# Altium schematic sheet FULL_CB_Servo_REV_C.SchDoc
size A4; DrawnBy: Philip Rowse
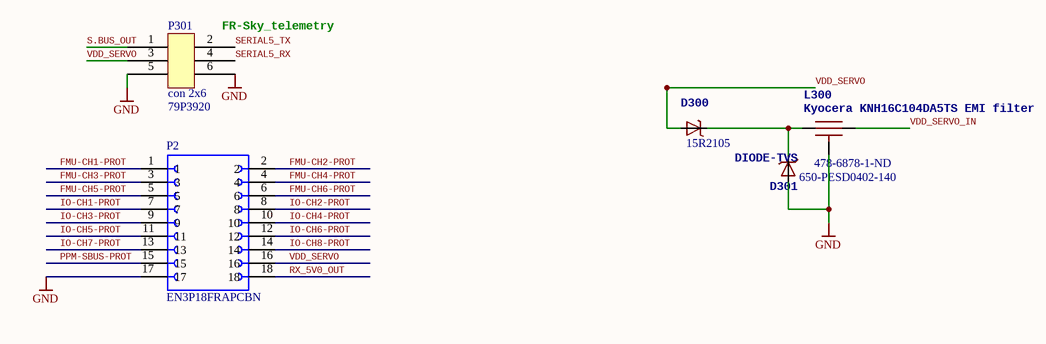
[diagram p0: FULL_CB_Servo_REV_C.SchDoc]

## Parts
D300  Supplier Part Number 1: 15R2105  [MICROSMP]  (hidden comment: MSS1P4-M3)
D301  DIODE-TVS  Supplier Part Number 1: 650-PESD0402-140  [0402-TVS]
L300  Kyocera KNH16C104DA5TS EMI filter  Supplier Part Number 1: 478-6878-1-ND  [KYOCERA-KNH16-DA]
P2  EN3P18FRAPCBN  [SWITCHCRAFT_EN3P18FRAPCBN]
P301  con 2x6  Supplier Part Number 1: 79P3920  [TSW-103-07-G-D]

## Nets
GND: D301.A L300.GND P2.17 P301.5 P301.6
FMU-CH1-PROT: P2.1
FMU-CH2-PROT: P2.2
FMU-CH3-PROT: P2.3
FMU-CH4-PROT: P2.4
FMU-CH5-PROT: P2.5
FMU-CH6-PROT: P2.6
IO-CH1-PROT: P2.7
IO-CH2-PROT: P2.8
IO-CH3-PROT: P2.9
IO-CH4-PROT: P2.10
IO-CH5-PROT: P2.11
IO-CH6-PROT: P2.12
IO-CH7-PROT: P2.13
IO-CH8-PROT: P2.14
PPM-SBUS-PROT: P2.15
RX_5V0_OUT: P2.18
S.BUS_OUT: P301.1
SERIAL5_RX: P301.4
SERIAL5_TX: P301.2
VDD_SERVO: D300.ANODE(A) P2.16 P301.3
VDD_SERVO_IN: L300.P$2
NetD300_CATHODE: D300.CATHODE(C) D301.C L300.P$1

## Notes on the sheet
- (near P301) FR-Sky_telemetry
- Title
- Size:
- Date:
- A4
- Number:
- Time:
- Revision:
- Sheet
- of
- File:

## Library data of the parts
D300 = DIODE-SCHOTTKY_MSMP: Diode, Schottky, 40V, 1A, MicroSMP, SMD; Supplier 1: Newark
D301 = DIODE-TVS: Diode, TVS, 14VWM, 40VC, 0402, SMD; Supplier 1: Mouser
L300 = KNH16C104DA5TS: Capacitor, Filter, 0.1uF, 25V, 2A, 0603, SMD; Supplier 1: Digi-Key
P301 = con 2x6: Connector, Header, 6Pos, 2.54MM, Vert, THT, Au; Supplier 1: Newark
P2 = EN3P18FRAPCBN: Package: None; Price: None; Value: *; MP: EN3P18FRAPCBN; Availability: Unavailable